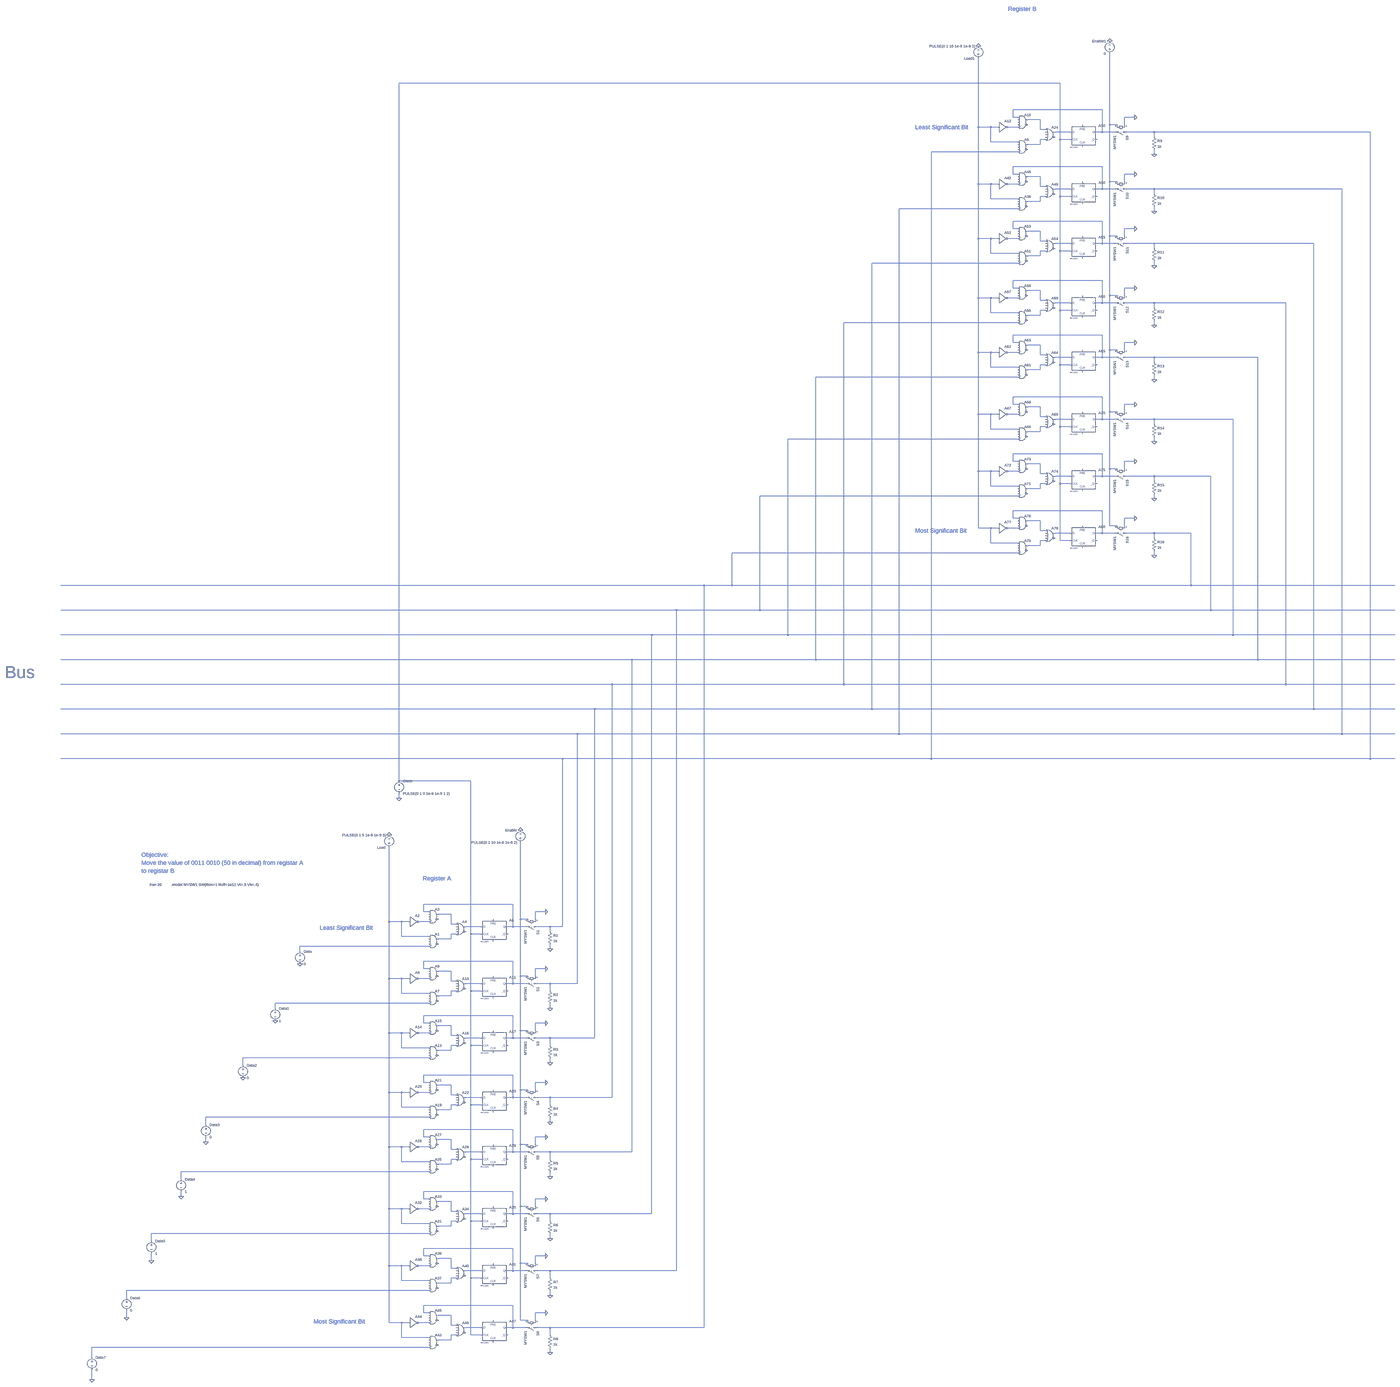
[diagram p0: schematic 8 Bit Register Transfer.asc, whole sheet]
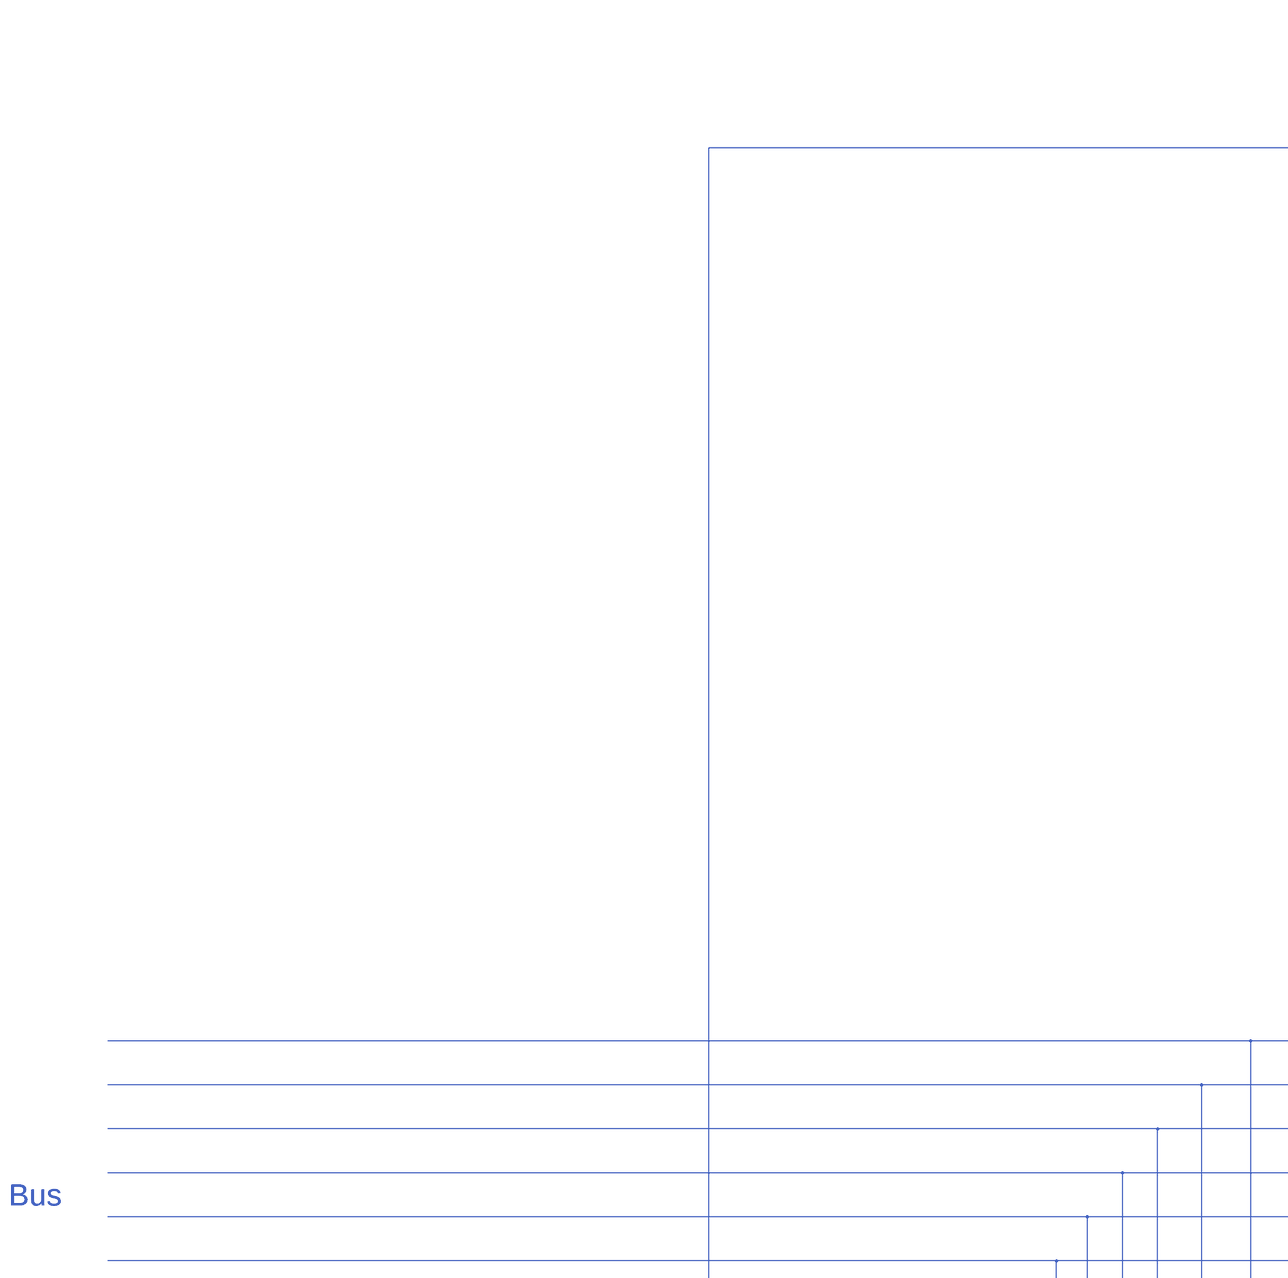
[diagram p1: schematic 8 Bit Register Transfer.asc, part, row 1 of 2, column 1 of 2]
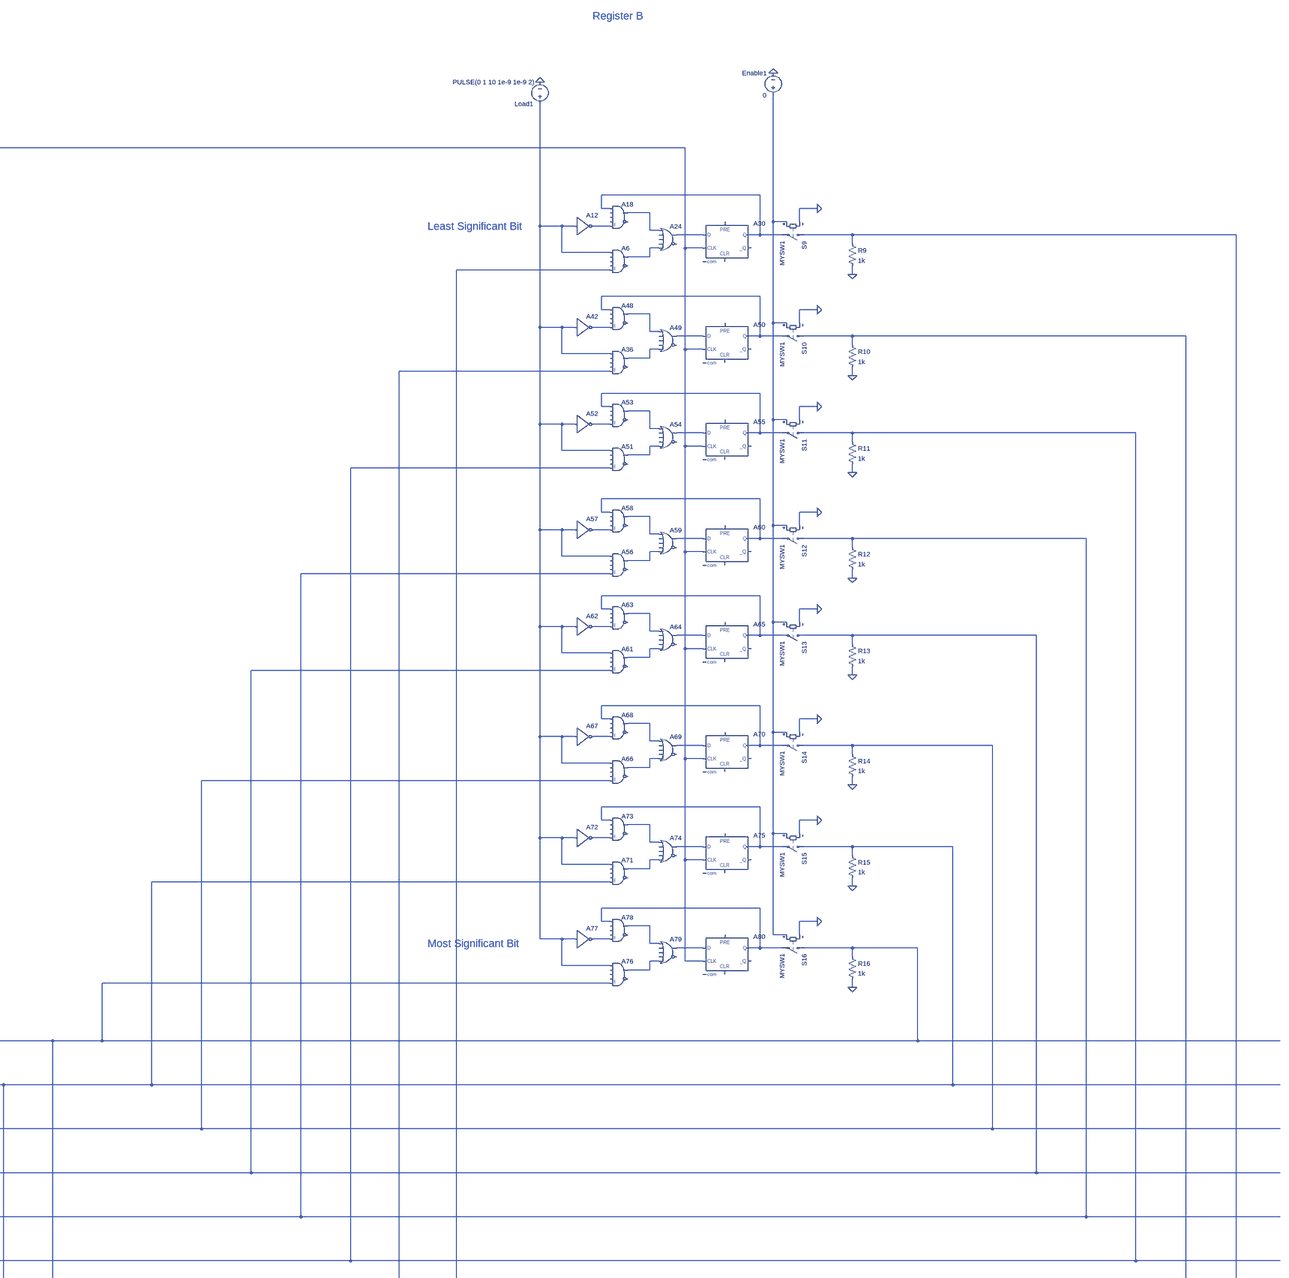
[diagram p2: schematic 8 Bit Register Transfer.asc, part, row 1 of 2, column 2 of 2]
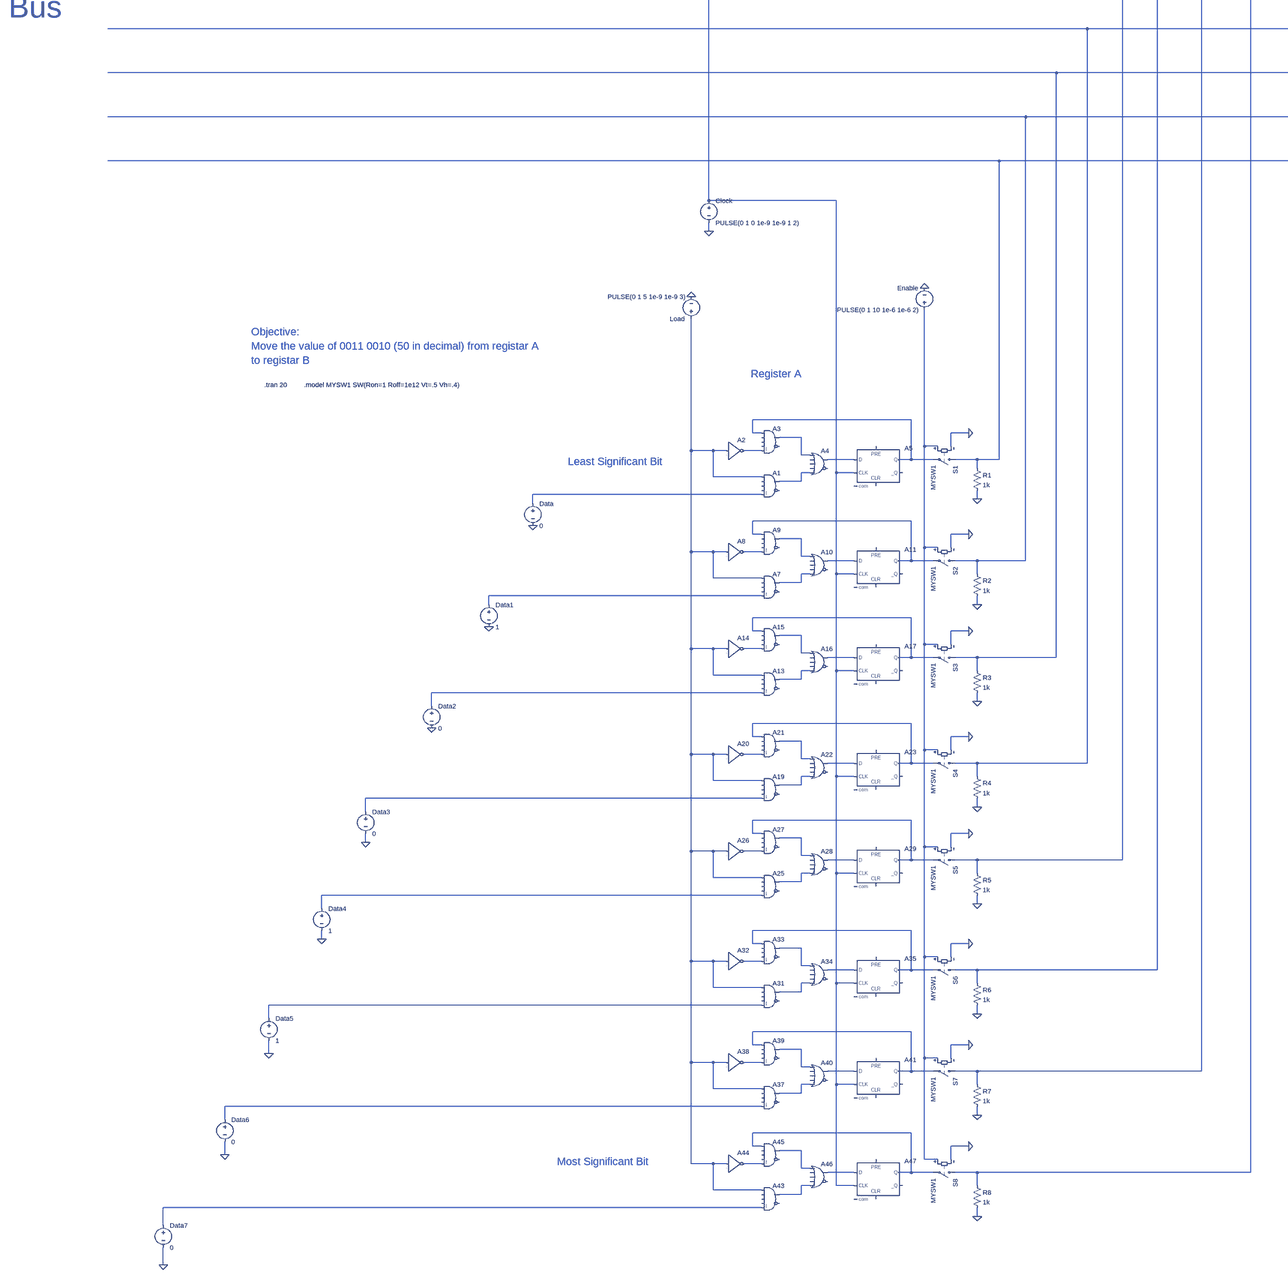
[diagram p3: schematic 8 Bit Register Transfer.asc, part, row 2 of 2, column 1 of 2]
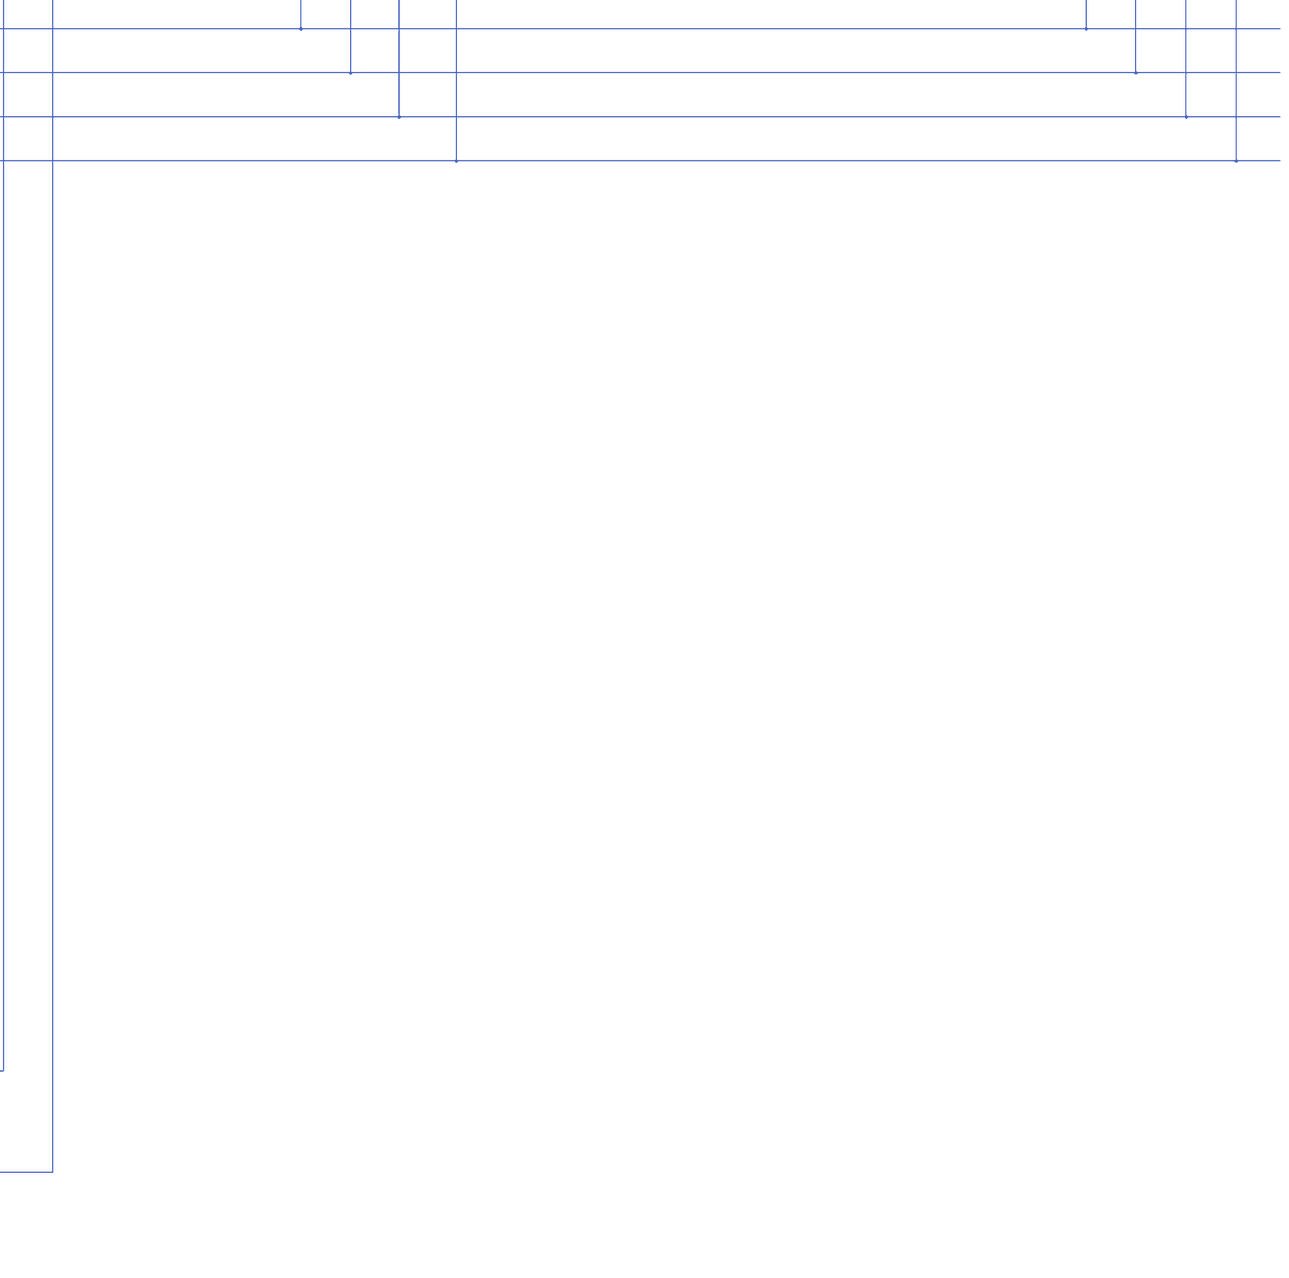
[diagram p4: schematic 8 Bit Register Transfer.asc, part, row 2 of 2, column 2 of 2]
8 Bit Register Transfer.asc, the LTspice schematic file:
Version 4
SHEET 1 12628 3668
WIRE 10256 -6368 4304 -6368
WIRE 10528 -6160 9952 -6160
WIRE 9952 -6112 9952 -6160
WIRE 9984 -6112 9952 -6112
WIRE 10736 -6112 10672 -6112
WIRE 10128 -6096 10048 -6096
WIRE 10576 -6064 10576 -6560
WIRE 10624 -6064 10576 -6064
WIRE 10672 -6064 10672 -6112
WIRE 9728 -6048 9728 -6528
WIRE 9808 -6048 9728 -6048
WIRE 9856 -6048 9808 -6048
WIRE 9984 -6048 9920 -6048
WIRE 10128 -6032 10128 -6096
WIRE 10160 -6032 10128 -6032
WIRE 10320 -6016 10224 -6016
WIRE 10528 -6016 10528 -6160
WIRE 10528 -6016 10480 -6016
WIRE 10608 -6016 10528 -6016
WIRE 10864 -6016 10688 -6016
WIRE 12464 -6016 10864 -6016
WIRE 10864 -5984 10864 -6016
WIRE 10160 -5968 10128 -5968
WIRE 10256 -5968 10256 -6368
WIRE 10320 -5968 10256 -5968
WIRE 9808 -5952 9808 -6048
WIRE 9984 -5952 9808 -5952
WIRE 10128 -5936 10128 -5968
WIRE 10128 -5936 10048 -5936
WIRE 9984 -5888 9424 -5888
WIRE 10864 -5872 10864 -5904
WIRE 10528 -5792 9952 -5792
WIRE 9952 -5744 9952 -5792
WIRE 9984 -5744 9952 -5744
WIRE 10736 -5744 10672 -5744
WIRE 10128 -5728 10048 -5728
WIRE 10576 -5696 10576 -6064
WIRE 10624 -5696 10576 -5696
WIRE 10672 -5696 10672 -5744
WIRE 9728 -5680 9728 -6048
WIRE 9808 -5680 9728 -5680
WIRE 9856 -5680 9808 -5680
WIRE 9984 -5680 9920 -5680
WIRE 10128 -5664 10128 -5728
WIRE 10160 -5664 10128 -5664
WIRE 10320 -5648 10224 -5648
WIRE 10528 -5648 10528 -5792
WIRE 10528 -5648 10480 -5648
WIRE 10608 -5648 10528 -5648
WIRE 10864 -5648 10688 -5648
WIRE 12208 -5648 10864 -5648
WIRE 10864 -5616 10864 -5648
WIRE 10160 -5600 10128 -5600
WIRE 10256 -5600 10256 -5968
WIRE 10320 -5600 10256 -5600
WIRE 9808 -5584 9808 -5680
WIRE 9984 -5584 9808 -5584
WIRE 10128 -5568 10128 -5600
WIRE 10128 -5568 10048 -5568
WIRE 9984 -5520 9216 -5520
WIRE 10864 -5504 10864 -5536
WIRE 10528 -5440 9952 -5440
WIRE 9952 -5392 9952 -5440
WIRE 9984 -5392 9952 -5392
WIRE 10736 -5392 10672 -5392
WIRE 10128 -5376 10048 -5376
WIRE 10576 -5344 10576 -5696
WIRE 10624 -5344 10576 -5344
WIRE 10672 -5344 10672 -5392
WIRE 9728 -5328 9728 -5680
WIRE 9808 -5328 9728 -5328
WIRE 9856 -5328 9808 -5328
WIRE 9984 -5328 9920 -5328
WIRE 10128 -5312 10128 -5376
WIRE 10160 -5312 10128 -5312
WIRE 10320 -5296 10224 -5296
WIRE 10528 -5296 10528 -5440
WIRE 10528 -5296 10480 -5296
WIRE 10608 -5296 10528 -5296
WIRE 10864 -5296 10688 -5296
WIRE 11984 -5296 10864 -5296
WIRE 10864 -5264 10864 -5296
WIRE 10160 -5248 10128 -5248
WIRE 10256 -5248 10256 -5600
WIRE 10320 -5248 10256 -5248
WIRE 9808 -5232 9808 -5328
WIRE 9984 -5232 9808 -5232
WIRE 10128 -5216 10128 -5248
WIRE 10128 -5216 10048 -5216
WIRE 9984 -5168 9040 -5168
WIRE 10864 -5152 10864 -5184
WIRE 10528 -5056 9952 -5056
WIRE 9952 -5008 9952 -5056
WIRE 9984 -5008 9952 -5008
WIRE 10736 -5008 10672 -5008
WIRE 10128 -4992 10048 -4992
WIRE 10576 -4960 10576 -5344
WIRE 10624 -4960 10576 -4960
WIRE 10672 -4960 10672 -5008
WIRE 9728 -4944 9728 -5328
WIRE 9808 -4944 9728 -4944
WIRE 9856 -4944 9808 -4944
WIRE 9984 -4944 9920 -4944
WIRE 10128 -4928 10128 -4992
WIRE 10160 -4928 10128 -4928
WIRE 10320 -4912 10224 -4912
WIRE 10528 -4912 10528 -5056
WIRE 10528 -4912 10480 -4912
WIRE 10608 -4912 10528 -4912
WIRE 10864 -4912 10688 -4912
WIRE 11744 -4912 10864 -4912
WIRE 10864 -4880 10864 -4912
WIRE 10160 -4864 10128 -4864
WIRE 10256 -4864 10256 -5248
WIRE 10320 -4864 10256 -4864
WIRE 9808 -4848 9808 -4944
WIRE 9984 -4848 9808 -4848
WIRE 10128 -4832 10128 -4864
WIRE 10128 -4832 10048 -4832
WIRE 9984 -4784 8848 -4784
WIRE 10864 -4768 10864 -4800
WIRE 10528 -4704 9952 -4704
WIRE 9952 -4656 9952 -4704
WIRE 9984 -4656 9952 -4656
WIRE 10736 -4656 10672 -4656
WIRE 10128 -4640 10048 -4640
WIRE 10576 -4608 10576 -4960
WIRE 10624 -4608 10576 -4608
WIRE 10672 -4608 10672 -4656
WIRE 9728 -4592 9728 -4944
WIRE 9808 -4592 9728 -4592
WIRE 9856 -4592 9808 -4592
WIRE 9984 -4592 9920 -4592
WIRE 10128 -4576 10128 -4640
WIRE 10160 -4576 10128 -4576
WIRE 10320 -4560 10224 -4560
WIRE 10528 -4560 10528 -4704
WIRE 10528 -4560 10480 -4560
WIRE 10608 -4560 10528 -4560
WIRE 10864 -4560 10688 -4560
WIRE 11536 -4560 10864 -4560
WIRE 10864 -4528 10864 -4560
WIRE 10160 -4512 10128 -4512
WIRE 10256 -4512 10256 -4864
WIRE 10320 -4512 10256 -4512
WIRE 9808 -4496 9808 -4592
WIRE 9984 -4496 9808 -4496
WIRE 10128 -4480 10128 -4512
WIRE 10128 -4480 10048 -4480
WIRE 9984 -4432 8640 -4432
WIRE 10864 -4416 10864 -4448
WIRE 10528 -4304 9952 -4304
WIRE 9952 -4256 9952 -4304
WIRE 9984 -4256 9952 -4256
WIRE 10736 -4256 10672 -4256
WIRE 10128 -4240 10048 -4240
WIRE 10576 -4208 10576 -4608
WIRE 10624 -4208 10576 -4208
WIRE 10672 -4208 10672 -4256
WIRE 9728 -4192 9728 -4592
WIRE 9808 -4192 9728 -4192
WIRE 9856 -4192 9808 -4192
WIRE 9984 -4192 9920 -4192
WIRE 10128 -4176 10128 -4240
WIRE 10160 -4176 10128 -4176
WIRE 10320 -4160 10224 -4160
WIRE 10528 -4160 10528 -4304
WIRE 10528 -4160 10480 -4160
WIRE 10608 -4160 10528 -4160
WIRE 10864 -4160 10688 -4160
WIRE 11376 -4160 10864 -4160
WIRE 10864 -4128 10864 -4160
WIRE 10160 -4112 10128 -4112
WIRE 10256 -4112 10256 -4512
WIRE 10320 -4112 10256 -4112
WIRE 9808 -4096 9808 -4192
WIRE 9984 -4096 9808 -4096
WIRE 10128 -4080 10128 -4112
WIRE 10128 -4080 10048 -4080
WIRE 9984 -4032 8416 -4032
WIRE 10864 -4016 10864 -4048
WIRE 10528 -3936 9952 -3936
WIRE 9952 -3888 9952 -3936
WIRE 9984 -3888 9952 -3888
WIRE 10736 -3888 10672 -3888
WIRE 10128 -3872 10048 -3872
WIRE 10576 -3840 10576 -4208
WIRE 10624 -3840 10576 -3840
WIRE 10672 -3840 10672 -3888
WIRE 9728 -3824 9728 -4192
WIRE 9808 -3824 9728 -3824
WIRE 9856 -3824 9808 -3824
WIRE 9984 -3824 9920 -3824
WIRE 10128 -3808 10128 -3872
WIRE 10160 -3808 10128 -3808
WIRE 10320 -3792 10224 -3792
WIRE 10528 -3792 10528 -3936
WIRE 10528 -3792 10480 -3792
WIRE 10608 -3792 10528 -3792
WIRE 10864 -3792 10688 -3792
WIRE 11232 -3792 10864 -3792
WIRE 10864 -3760 10864 -3792
WIRE 10160 -3744 10128 -3744
WIRE 10256 -3744 10256 -4112
WIRE 10320 -3744 10256 -3744
WIRE 9808 -3728 9808 -3824
WIRE 9984 -3728 9808 -3728
WIRE 10128 -3712 10128 -3744
WIRE 10128 -3712 10048 -3712
WIRE 9984 -3664 8224 -3664
WIRE 10864 -3648 10864 -3680
WIRE 10528 -3568 9952 -3568
WIRE 9952 -3520 9952 -3568
WIRE 9984 -3520 9952 -3520
WIRE 10736 -3520 10672 -3520
WIRE 10128 -3504 10048 -3504
WIRE 10576 -3472 10576 -3840
WIRE 10624 -3472 10576 -3472
WIRE 10672 -3472 10672 -3520
WIRE 9728 -3456 9728 -3824
WIRE 9808 -3456 9728 -3456
WIRE 9856 -3456 9808 -3456
WIRE 9984 -3456 9920 -3456
WIRE 10128 -3440 10128 -3504
WIRE 10160 -3440 10128 -3440
WIRE 10320 -3424 10224 -3424
WIRE 10528 -3424 10528 -3568
WIRE 10528 -3424 10480 -3424
WIRE 10608 -3424 10528 -3424
WIRE 10864 -3424 10688 -3424
WIRE 11104 -3424 10864 -3424
WIRE 10864 -3392 10864 -3424
WIRE 10160 -3376 10128 -3376
WIRE 10256 -3376 10256 -3744
WIRE 10320 -3376 10256 -3376
WIRE 9808 -3360 9808 -3456
WIRE 9984 -3360 9808 -3360
WIRE 10128 -3344 10128 -3376
WIRE 10128 -3344 10048 -3344
WIRE 9984 -3296 8000 -3296
WIRE 10864 -3280 10864 -3312
WIRE 6288 -2912 128 -2912
WIRE 8000 -2912 8000 -3296
WIRE 8000 -2912 6288 -2912
WIRE 11104 -2912 11104 -3424
WIRE 11104 -2912 8000 -2912
WIRE 12624 -2912 11104 -2912
WIRE 6096 -2752 128 -2752
WIRE 8224 -2752 8224 -3664
WIRE 8224 -2752 6096 -2752
WIRE 11232 -2752 11232 -3792
WIRE 11232 -2752 8224 -2752
WIRE 12624 -2752 11232 -2752
WIRE 5936 -2592 128 -2592
WIRE 8416 -2592 8416 -4032
WIRE 8416 -2592 5936 -2592
WIRE 11376 -2592 11376 -4160
WIRE 11376 -2592 8416 -2592
WIRE 12624 -2592 11376 -2592
WIRE 5808 -2432 128 -2432
WIRE 8640 -2432 8640 -4432
WIRE 8640 -2432 5808 -2432
WIRE 11536 -2432 11536 -4560
WIRE 11536 -2432 8640 -2432
WIRE 12624 -2432 11536 -2432
WIRE 5680 -2272 128 -2272
WIRE 8848 -2272 8848 -4784
WIRE 8848 -2272 5680 -2272
WIRE 11744 -2272 11744 -4912
WIRE 11744 -2272 8848 -2272
WIRE 12624 -2272 11744 -2272
WIRE 5568 -2112 128 -2112
WIRE 9040 -2112 9040 -5168
WIRE 9040 -2112 5568 -2112
WIRE 11984 -2112 11984 -5296
WIRE 11984 -2112 9040 -2112
WIRE 12624 -2112 11984 -2112
WIRE 5456 -1952 128 -1952
WIRE 9216 -1952 9216 -5520
WIRE 9216 -1952 5456 -1952
WIRE 12208 -1952 12208 -5648
WIRE 12208 -1952 9216 -1952
WIRE 12624 -1952 12208 -1952
WIRE 5360 -1792 128 -1792
WIRE 9424 -1792 9424 -5888
WIRE 9424 -1792 5360 -1792
WIRE 12464 -1792 12464 -6016
WIRE 12464 -1792 9424 -1792
WIRE 12624 -1792 12464 -1792
WIRE 4304 -1648 4304 -6368
WIRE 4768 -1648 4304 -1648
WIRE 4304 -1536 4304 -1568
WIRE 5040 -848 4464 -848
WIRE 4464 -800 4464 -848
WIRE 4496 -800 4464 -800
WIRE 5248 -800 5184 -800
WIRE 4640 -784 4560 -784
WIRE 5088 -752 5088 -1248
WIRE 5136 -752 5088 -752
WIRE 5184 -752 5184 -800
WIRE 4240 -736 4240 -1216
WIRE 4320 -736 4240 -736
WIRE 4368 -736 4320 -736
WIRE 4496 -736 4432 -736
WIRE 4640 -720 4640 -784
WIRE 4672 -720 4640 -720
WIRE 4832 -704 4736 -704
WIRE 5040 -704 5040 -848
WIRE 5040 -704 4992 -704
WIRE 5120 -704 5040 -704
WIRE 5280 -704 5200 -704
WIRE 5360 -704 5360 -1792
WIRE 5360 -704 5280 -704
WIRE 5280 -672 5280 -704
WIRE 4672 -656 4640 -656
WIRE 4768 -656 4768 -1648
WIRE 4832 -656 4768 -656
WIRE 4320 -640 4320 -736
WIRE 4496 -640 4320 -640
WIRE 4640 -624 4640 -656
WIRE 4640 -624 4560 -624
WIRE 4496 -576 3664 -576
WIRE 5280 -560 5280 -592
WIRE 3664 -544 3664 -576
WIRE 5040 -480 4464 -480
WIRE 4464 -432 4464 -480
WIRE 4496 -432 4464 -432
WIRE 5248 -432 5184 -432
WIRE 4640 -416 4560 -416
WIRE 5088 -384 5088 -752
WIRE 5136 -384 5088 -384
WIRE 5184 -384 5184 -432
WIRE 4240 -368 4240 -736
WIRE 4320 -368 4240 -368
WIRE 4368 -368 4320 -368
WIRE 4496 -368 4432 -368
WIRE 4640 -352 4640 -416
WIRE 4672 -352 4640 -352
WIRE 4832 -336 4736 -336
WIRE 5040 -336 5040 -480
WIRE 5040 -336 4992 -336
WIRE 5120 -336 5040 -336
WIRE 5280 -336 5200 -336
WIRE 5456 -336 5456 -1952
WIRE 5456 -336 5280 -336
WIRE 4672 -288 4640 -288
WIRE 4768 -288 4768 -656
WIRE 4832 -288 4768 -288
WIRE 5280 -288 5280 -336
WIRE 4320 -272 4320 -368
WIRE 4496 -272 4320 -272
WIRE 4640 -256 4640 -288
WIRE 4640 -256 4560 -256
WIRE 4496 -208 3504 -208
WIRE 3504 -176 3504 -208
WIRE 5280 -176 5280 -208
WIRE 5040 -128 4464 -128
WIRE 4464 -80 4464 -128
WIRE 4496 -80 4464 -80
WIRE 5248 -80 5184 -80
WIRE 4640 -64 4560 -64
WIRE 5088 -32 5088 -384
WIRE 5136 -32 5088 -32
WIRE 5184 -32 5184 -80
WIRE 4240 -16 4240 -368
WIRE 4320 -16 4240 -16
WIRE 4368 -16 4320 -16
WIRE 4496 -16 4432 -16
WIRE 4640 0 4640 -64
WIRE 4672 0 4640 0
WIRE 4832 16 4736 16
WIRE 5040 16 5040 -128
WIRE 5040 16 4992 16
WIRE 5120 16 5040 16
WIRE 5280 16 5200 16
WIRE 5568 16 5568 -2112
WIRE 5568 16 5280 16
WIRE 4672 64 4640 64
WIRE 4768 64 4768 -288
WIRE 4832 64 4768 64
WIRE 5280 64 5280 16
WIRE 4320 80 4320 -16
WIRE 4496 80 4320 80
WIRE 4640 96 4640 64
WIRE 4640 96 4560 96
WIRE 4496 144 3296 144
WIRE 5280 176 5280 144
WIRE 3296 192 3296 144
WIRE 5040 256 4464 256
WIRE 4464 304 4464 256
WIRE 4496 304 4464 304
WIRE 5248 304 5184 304
WIRE 4640 320 4560 320
WIRE 5088 352 5088 -32
WIRE 5136 352 5088 352
WIRE 5184 352 5184 304
WIRE 4240 368 4240 -16
WIRE 4320 368 4240 368
WIRE 4368 368 4320 368
WIRE 4496 368 4432 368
WIRE 4640 384 4640 320
WIRE 4672 384 4640 384
WIRE 4832 400 4736 400
WIRE 5040 400 5040 256
WIRE 5040 400 4992 400
WIRE 5120 400 5040 400
WIRE 5280 400 5200 400
WIRE 5680 400 5680 -2272
WIRE 5680 400 5280 400
WIRE 4672 448 4640 448
WIRE 4768 448 4768 64
WIRE 4832 448 4768 448
WIRE 5280 448 5280 400
WIRE 4320 464 4320 368
WIRE 4496 464 4320 464
WIRE 4640 480 4640 448
WIRE 4640 480 4560 480
WIRE 4496 528 3056 528
WIRE 5280 560 5280 528
WIRE 3056 576 3056 528
WIRE 5040 608 4464 608
WIRE 4464 656 4464 608
WIRE 4496 656 4464 656
WIRE 5248 656 5184 656
WIRE 4640 672 4560 672
WIRE 3056 688 3056 656
WIRE 5088 704 5088 352
WIRE 5136 704 5088 704
WIRE 5184 704 5184 656
WIRE 4240 720 4240 368
WIRE 4320 720 4240 720
WIRE 4368 720 4320 720
WIRE 4496 720 4432 720
WIRE 4640 736 4640 672
WIRE 4672 736 4640 736
WIRE 4832 752 4736 752
WIRE 5040 752 5040 608
WIRE 5040 752 4992 752
WIRE 5120 752 5040 752
WIRE 5280 752 5200 752
WIRE 5808 752 5808 -2432
WIRE 5808 752 5280 752
WIRE 4672 800 4640 800
WIRE 4768 800 4768 448
WIRE 4832 800 4768 800
WIRE 5280 800 5280 752
WIRE 4320 816 4320 720
WIRE 4496 816 4320 816
WIRE 4640 832 4640 800
WIRE 4640 832 4560 832
WIRE 4496 880 2896 880
WIRE 5280 912 5280 880
WIRE 2896 928 2896 880
WIRE 5040 1008 4464 1008
WIRE 2896 1040 2896 1008
WIRE 4464 1056 4464 1008
WIRE 4496 1056 4464 1056
WIRE 5248 1056 5184 1056
WIRE 4640 1072 4560 1072
WIRE 5088 1104 5088 704
WIRE 5136 1104 5088 1104
WIRE 5184 1104 5184 1056
WIRE 4240 1120 4240 720
WIRE 4320 1120 4240 1120
WIRE 4368 1120 4320 1120
WIRE 4496 1120 4432 1120
WIRE 4640 1136 4640 1072
WIRE 4672 1136 4640 1136
WIRE 4832 1152 4736 1152
WIRE 5040 1152 5040 1008
WIRE 5040 1152 4992 1152
WIRE 5120 1152 5040 1152
WIRE 5280 1152 5200 1152
WIRE 5936 1152 5936 -2592
WIRE 5936 1152 5280 1152
WIRE 4672 1200 4640 1200
WIRE 4768 1200 4768 800
WIRE 4832 1200 4768 1200
WIRE 5280 1200 5280 1152
WIRE 4320 1216 4320 1120
WIRE 4496 1216 4320 1216
WIRE 4640 1232 4640 1200
WIRE 4640 1232 4560 1232
WIRE 4496 1280 2704 1280
WIRE 5280 1312 5280 1280
WIRE 2704 1328 2704 1280
WIRE 5040 1376 4464 1376
WIRE 4464 1424 4464 1376
WIRE 4496 1424 4464 1424
WIRE 5248 1424 5184 1424
WIRE 4640 1440 4560 1440
WIRE 2704 1456 2704 1408
WIRE 5088 1472 5088 1104
WIRE 5136 1472 5088 1472
WIRE 5184 1472 5184 1424
WIRE 4240 1488 4240 1120
WIRE 4320 1488 4240 1488
WIRE 4368 1488 4320 1488
WIRE 4496 1488 4432 1488
WIRE 4640 1504 4640 1440
WIRE 4672 1504 4640 1504
WIRE 4832 1520 4736 1520
WIRE 5040 1520 5040 1376
WIRE 5040 1520 4992 1520
WIRE 5120 1520 5040 1520
WIRE 5280 1520 5200 1520
WIRE 6096 1520 6096 -2752
WIRE 6096 1520 5280 1520
WIRE 4672 1568 4640 1568
WIRE 4768 1568 4768 1200
WIRE 4832 1568 4768 1568
WIRE 5280 1568 5280 1520
WIRE 4320 1584 4320 1488
WIRE 4496 1584 4320 1584
WIRE 4640 1600 4640 1568
WIRE 4640 1600 4560 1600
WIRE 4496 1648 2544 1648
WIRE 5280 1680 5280 1648
WIRE 2544 1696 2544 1648
WIRE 5040 1744 4464 1744
WIRE 4464 1792 4464 1744
WIRE 4496 1792 4464 1792
WIRE 5248 1792 5184 1792
WIRE 4640 1808 4560 1808
WIRE 2544 1824 2544 1776
WIRE 5088 1840 5088 1472
WIRE 5136 1840 5088 1840
WIRE 5184 1840 5184 1792
WIRE 4240 1856 4240 1488
WIRE 4320 1856 4240 1856
WIRE 4368 1856 4320 1856
WIRE 4496 1856 4432 1856
WIRE 4640 1872 4640 1808
WIRE 4672 1872 4640 1872
WIRE 4832 1888 4736 1888
WIRE 5040 1888 5040 1744
WIRE 5040 1888 4992 1888
WIRE 5120 1888 5040 1888
WIRE 5280 1888 5200 1888
WIRE 6288 1888 6288 -2912
WIRE 6288 1888 5280 1888
WIRE 4672 1936 4640 1936
WIRE 4768 1936 4768 1568
WIRE 4832 1936 4768 1936
WIRE 5280 1936 5280 1888
WIRE 4320 1952 4320 1856
WIRE 4496 1952 4320 1952
WIRE 4640 1968 4640 1936
WIRE 4640 1968 4560 1968
WIRE 4496 2016 2320 2016
WIRE 5280 2048 5280 2016
WIRE 2320 2080 2320 2016
WIRE 2320 2224 2320 2160
FLAG 3664 -464 0
FLAG 4240 -1296 0
FLAG 3504 -96 0
FLAG 3296 272 0
FLAG 3056 688 0
FLAG 2896 1040 0
FLAG 2704 1456 0
FLAG 2544 1824 0
FLAG 2320 2224 0
FLAG 5248 -800 0
FLAG 5088 -1328 0
FLAG 5248 -432 0
FLAG 5248 -80 0
FLAG 5248 304 0
FLAG 5248 656 0
FLAG 5248 1056 0
FLAG 5248 1424 0
FLAG 5248 1792 0
FLAG 9728 -6608 0
FLAG 10736 -6112 0
FLAG 10576 -6640 0
FLAG 10736 -5744 0
FLAG 10736 -5392 0
FLAG 10736 -5008 0
FLAG 10736 -4656 0
FLAG 10736 -4256 0
FLAG 10736 -3888 0
FLAG 10736 -3520 0
FLAG 5280 -560 0
FLAG 5280 -176 0
FLAG 5280 176 0
FLAG 5280 560 0
FLAG 5280 912 0
FLAG 5280 1312 0
FLAG 5280 1680 0
FLAG 5280 2048 0
FLAG 4304 -1536 0
FLAG 10864 -5872 0
FLAG 10864 -5504 0
FLAG 10864 -5152 0
FLAG 10864 -4768 0
FLAG 10864 -4416 0
FLAG 10864 -4016 0
FLAG 10864 -3648 0
FLAG 10864 -3280 0
SYMBOL voltage 3664 -560 R0
WINDOW 123 0 0 Left 0
WINDOW 39 0 0 Left 0
SYMATTR InstName Data
SYMATTR Value 0
SYMBOL voltage 4240 -1200 R180
WINDOW 123 0 0 Left 0
WINDOW 39 0 0 Left 0
SYMATTR InstName Load
SYMATTR Value PULSE(0 1 5 1e-9 1e-9 3)
SYMBOL Digital\\and 4528 -672 R0
SYMATTR InstName A1
SYMBOL Digital\\inv 4368 -800 R0
SYMATTR InstName A2
SYMBOL Digital\\and 4528 -832 R0
SYMATTR InstName A3
SYMBOL Digital\\or 4704 -752 R0
SYMATTR InstName A4
SYMBOL Digital\\dflop 4912 -752 R0
SYMATTR InstName A5
SYMBOL voltage 4304 -1664 R0
WINDOW 123 0 0 Left 0
WINDOW 39 0 0 Left 0
SYMATTR InstName Clock
SYMATTR Value PULSE(0 1 0 1e-9 1e-9 1 2)
SYMBOL Digital\\and 4528 -304 R0
SYMATTR InstName A7
SYMBOL Digital\\inv 4368 -432 R0
SYMATTR InstName A8
SYMBOL Digital\\and 4528 -464 R0
SYMATTR InstName A9
SYMBOL Digital\\or 4704 -384 R0
SYMATTR InstName A10
SYMBOL Digital\\dflop 4912 -384 R0
SYMATTR InstName A11
SYMBOL Digital\\and 4528 48 R0
SYMATTR InstName A13
SYMBOL Digital\\inv 4368 -80 R0
SYMATTR InstName A14
SYMBOL Digital\\and 4528 -112 R0
SYMATTR InstName A15
SYMBOL Digital\\or 4704 -32 R0
SYMATTR InstName A16
SYMBOL Digital\\dflop 4912 -32 R0
SYMATTR InstName A17
SYMBOL Digital\\and 4528 432 R0
SYMATTR InstName A19
SYMBOL Digital\\inv 4368 304 R0
SYMATTR InstName A20
SYMBOL Digital\\and 4528 272 R0
SYMATTR InstName A21
SYMBOL Digital\\or 4704 352 R0
SYMATTR InstName A22
SYMBOL Digital\\dflop 4912 352 R0
SYMATTR InstName A23
SYMBOL Digital\\and 4528 784 R0
SYMATTR InstName A25
SYMBOL Digital\\inv 4368 656 R0
SYMATTR InstName A26
SYMBOL Digital\\and 4528 624 R0
SYMATTR InstName A27
SYMBOL Digital\\or 4704 704 R0
SYMATTR InstName A28
SYMBOL Digital\\dflop 4912 704 R0
SYMATTR InstName A29
SYMBOL Digital\\and 4528 1184 R0
SYMATTR InstName A31
SYMBOL Digital\\inv 4368 1056 R0
SYMATTR InstName A32
SYMBOL Digital\\and 4528 1024 R0
SYMATTR InstName A33
SYMBOL Digital\\or 4704 1104 R0
SYMATTR InstName A34
SYMBOL Digital\\dflop 4912 1104 R0
SYMATTR InstName A35
SYMBOL Digital\\and 4528 1552 R0
SYMATTR InstName A37
SYMBOL Digital\\inv 4368 1424 R0
SYMATTR InstName A38
SYMBOL Digital\\and 4528 1392 R0
SYMATTR InstName A39
SYMBOL Digital\\or 4704 1472 R0
SYMATTR InstName A40
SYMBOL Digital\\dflop 4912 1472 R0
SYMATTR InstName A41
SYMBOL Digital\\and 4528 1920 R0
SYMATTR InstName A43
SYMBOL Digital\\inv 4368 1792 R0
SYMATTR InstName A44
SYMBOL Digital\\and 4528 1760 R0
SYMATTR InstName A45
SYMBOL Digital\\or 4704 1840 R0
SYMATTR InstName A46
SYMBOL Digital\\dflop 4912 1840 R0
SYMATTR InstName A47
SYMBOL voltage 3504 -192 R0
WINDOW 123 0 0 Left 0
WINDOW 39 0 0 Left 0
SYMATTR InstName Data1
SYMATTR Value 1
SYMBOL voltage 3296 176 R0
WINDOW 123 0 0 Left 0
WINDOW 39 0 0 Left 0
SYMATTR InstName Data2
SYMATTR Value 0
SYMBOL voltage 3056 560 R0
WINDOW 123 0 0 Left 0
WINDOW 39 0 0 Left 0
SYMATTR InstName Data3
SYMATTR Value 0
SYMBOL voltage 2896 912 R0
WINDOW 123 0 0 Left 0
WINDOW 39 0 0 Left 0
SYMATTR InstName Data4
SYMATTR Value 1
SYMBOL voltage 2704 1312 R0
WINDOW 123 0 0 Left 0
WINDOW 39 0 0 Left 0
SYMATTR InstName Data5
SYMATTR Value 1
SYMBOL voltage 2544 1680 R0
WINDOW 123 0 0 Left 0
WINDOW 39 0 0 Left 0
SYMATTR InstName Data6
SYMATTR Value 0
SYMBOL voltage 2320 2064 R0
WINDOW 123 0 0 Left 0
WINDOW 39 0 0 Left 0
SYMATTR InstName Data7
SYMATTR Value 0
SYMBOL voltage 5088 -1232 R180
WINDOW 0 24 96 Left 2
WINDOW 3 24 16 Left 2
WINDOW 123 0 0 Left 0
WINDOW 39 0 0 Left 0
SYMATTR InstName Enable
SYMATTR Value PULSE(0 1 10 1e-6 1e-6 2)
SYMBOL sw 5216 -704 R90
SYMATTR InstName S1
SYMATTR Value MYSW1
SYMBOL sw 5216 -336 R90
SYMATTR InstName S2
SYMATTR Value MYSW1
SYMBOL sw 5216 16 R90
SYMATTR InstName S3
SYMATTR Value MYSW1
SYMBOL sw 5216 400 R90
SYMATTR InstName S4
SYMATTR Value MYSW1
SYMBOL sw 5216 752 R90
SYMATTR InstName S5
SYMATTR Value MYSW1
SYMBOL sw 5216 1152 R90
SYMATTR InstName S6
SYMATTR Value MYSW1
SYMBOL sw 5216 1520 R90
SYMATTR InstName S7
SYMATTR Value MYSW1
SYMBOL sw 5216 1888 R90
SYMATTR InstName S8
SYMATTR Value MYSW1
SYMBOL voltage 9728 -6512 R180
WINDOW 123 0 0 Left 0
WINDOW 39 0 0 Left 0
SYMATTR InstName Load1
SYMATTR Value PULSE(0 1 10 1e-9 1e-9 2)
SYMBOL Digital\\and 10016 -5984 R0
SYMATTR InstName A6
SYMBOL Digital\\inv 9856 -6112 R0
SYMATTR InstName A12
SYMBOL Digital\\and 10016 -6144 R0
SYMATTR InstName A18
SYMBOL Digital\\or 10192 -6064 R0
SYMATTR InstName A24
SYMBOL Digital\\dflop 10400 -6064 R0
SYMATTR InstName A30
SYMBOL Digital\\and 10016 -5616 R0
SYMATTR InstName A36
SYMBOL Digital\\inv 9856 -5744 R0
SYMATTR InstName A42
SYMBOL Digital\\and 10016 -5776 R0
SYMATTR InstName A48
SYMBOL Digital\\or 10192 -5696 R0
SYMATTR InstName A49
SYMBOL Digital\\dflop 10400 -5696 R0
SYMATTR InstName A50
SYMBOL Digital\\and 10016 -5264 R0
SYMATTR InstName A51
SYMBOL Digital\\inv 9856 -5392 R0
SYMATTR InstName A52
SYMBOL Digital\\and 10016 -5424 R0
SYMATTR InstName A53
SYMBOL Digital\\or 10192 -5344 R0
SYMATTR InstName A54
SYMBOL Digital\\dflop 10400 -5344 R0
SYMATTR InstName A55
SYMBOL Digital\\and 10016 -4880 R0
SYMATTR InstName A56
SYMBOL Digital\\inv 9856 -5008 R0
SYMATTR InstName A57
SYMBOL Digital\\and 10016 -5040 R0
SYMATTR InstName A58
SYMBOL Digital\\or 10192 -4960 R0
SYMATTR InstName A59
SYMBOL Digital\\dflop 10400 -4960 R0
SYMATTR InstName A60
SYMBOL Digital\\and 10016 -4528 R0
SYMATTR InstName A61
SYMBOL Digital\\inv 9856 -4656 R0
SYMATTR InstName A62
SYMBOL Digital\\and 10016 -4688 R0
SYMATTR InstName A63
SYMBOL Digital\\or 10192 -4608 R0
SYMATTR InstName A64
SYMBOL Digital\\dflop 10400 -4608 R0
SYMATTR InstName A65
SYMBOL Digital\\and 10016 -4128 R0
SYMATTR InstName A66
SYMBOL Digital\\inv 9856 -4256 R0
SYMATTR InstName A67
SYMBOL Digital\\and 10016 -4288 R0
SYMATTR InstName A68
SYMBOL Digital\\or 10192 -4208 R0
SYMATTR InstName A69
SYMBOL Digital\\dflop 10400 -4208 R0
SYMATTR InstName A70
SYMBOL Digital\\and 10016 -3760 R0
SYMATTR InstName A71
SYMBOL Digital\\inv 9856 -3888 R0
SYMATTR InstName A72
SYMBOL Digital\\and 10016 -3920 R0
SYMATTR InstName A73
SYMBOL Digital\\or 10192 -3840 R0
SYMATTR InstName A74
SYMBOL Digital\\dflop 10400 -3840 R0
SYMATTR InstName A75
SYMBOL Digital\\and 10016 -3392 R0
SYMATTR InstName A76
SYMBOL Digital\\inv 9856 -3520 R0
SYMATTR InstName A77
SYMBOL Digital\\and 10016 -3552 R0
SYMATTR InstName A78
SYMBOL Digital\\or 10192 -3472 R0
SYMATTR InstName A79
SYMBOL Digital\\dflop 10400 -3472 R0
SYMATTR InstName A80
SYMBOL voltage 10576 -6544 R180
WINDOW 0 24 96 Left 2
WINDOW 3 24 16 Left 2
WINDOW 123 0 0 Left 0
WINDOW 39 0 0 Left 0
SYMATTR InstName Enable1
SYMATTR Value 0
SYMBOL sw 10704 -6016 R90
SYMATTR InstName S9
SYMATTR Value MYSW1
SYMBOL sw 10704 -5648 R90
SYMATTR InstName S10
SYMATTR Value MYSW1
SYMBOL sw 10704 -5296 R90
SYMATTR InstName S11
SYMATTR Value MYSW1
SYMBOL sw 10704 -4912 R90
SYMATTR InstName S12
SYMATTR Value MYSW1
SYMBOL sw 10704 -4560 R90
SYMATTR InstName S13
SYMATTR Value MYSW1
SYMBOL sw 10704 -4160 R90
SYMATTR InstName S14
SYMATTR Value MYSW1
SYMBOL sw 10704 -3792 R90
SYMATTR InstName S15
SYMATTR Value MYSW1
SYMBOL sw 10704 -3424 R90
SYMATTR InstName S16
SYMATTR Value MYSW1
SYMBOL res 5264 -688 R0
SYMATTR InstName R1
SYMATTR Value 1k
SYMBOL res 5264 -304 R0
SYMATTR InstName R2
SYMATTR Value 1k
SYMBOL res 5264 48 R0
SYMATTR InstName R3
SYMATTR Value 1k
SYMBOL res 5264 432 R0
SYMATTR InstName R4
SYMATTR Value 1k
SYMBOL res 5264 784 R0
SYMATTR InstName R5
SYMATTR Value 1k
SYMBOL res 5264 1184 R0
SYMATTR InstName R6
SYMATTR Value 1k
SYMBOL res 5264 1552 R0
SYMATTR InstName R7
SYMATTR Value 1k
SYMBOL res 5264 1920 R0
SYMATTR InstName R8
SYMATTR Value 1k
SYMBOL res 10848 -6000 R0
SYMATTR InstName R9
SYMATTR Value 1k
SYMBOL res 10848 -5632 R0
SYMATTR InstName R10
SYMATTR Value 1k
SYMBOL res 10848 -5280 R0
SYMATTR InstName R11
SYMATTR Value 1k
SYMBOL res 10848 -4896 R0
SYMATTR InstName R12
SYMATTR Value 1k
SYMBOL res 10848 -4544 R0
SYMATTR InstName R13
SYMATTR Value 1k
SYMBOL res 10848 -4144 R0
SYMATTR InstName R14
SYMATTR Value 1k
SYMBOL res 10848 -3776 R0
SYMATTR InstName R15
SYMATTR Value 1k
SYMBOL res 10848 -3408 R0
SYMATTR InstName R16
SYMATTR Value 1k
TEXT 2688 -976 Left 2 !.tran 20
TEXT 4456 -1016 Left 4 ;Register A
TEXT 2832 -976 Left 2 !.model MYSW1 SW(Ron=1 Roff=1e12 Vt=.5 Vh=.4)
TEXT 9920 -6872 Left 4 ;Register B
TEXT 3792 -696 Left 4 ;Least Significant Bit
TEXT 3752 1848 Left 4 ;Most Significant Bit
TEXT 2640 -1168 Left 4 ;Objective:\nMove the value of 0011 0010 (50 in decimal) from registar A\nto registar B
TEXT 9320 -6048 Left 4 ;Least Significant Bit
TEXT 9320 -3440 Left 4 ;Most Significant Bit
TEXT -232 -2352 Left 7 ;Bus

The netlist it stands for:
* 8 Bit Register Transfer.asc
V§Data N059 0 0
V§Load N055 0 PULSE(0 1 5 1e-9 1e-9 3)
A1 N055 0 0 0 N059 0 N058 0 AND
A2 N055 0 0 0 0 N056 0 0 BUF
A3 N052 0 0 0 N056 0 N053 0 AND
A4 N053 0 0 0 N058 0 N057 0 OR
A5 N057 0 N001 0 0 0 N052 0 DFLOP
V§Clock N001 0 PULSE(0 1 0 1e-9 1e-9 1 2)
A7 N055 0 0 0 N065 0 N064 0 AND
A8 N055 0 0 0 0 N062 0 0 BUF
A9 N060 0 0 0 N062 0 N061 0 AND
A10 N061 0 0 0 N064 0 N063 0 OR
A11 N063 0 N001 0 0 0 N060 0 DFLOP
A13 N055 0 0 0 N071 0 N070 0 AND
A14 N055 0 0 0 0 N068 0 0 BUF
A15 N066 0 0 0 N068 0 N067 0 AND
A16 N067 0 0 0 N070 0 N069 0 OR
A17 N069 0 N001 0 0 0 N066 0 DFLOP
A19 N055 0 0 0 N077 0 N076 0 AND
A20 N055 0 0 0 0 N074 0 0 BUF
A21 N072 0 0 0 N074 0 N073 0 AND
A22 N073 0 0 0 N076 0 N075 0 OR
A23 N075 0 N001 0 0 0 N072 0 DFLOP
A25 N055 0 0 0 N083 0 N082 0 AND
A26 N055 0 0 0 0 N080 0 0 BUF
A27 N078 0 0 0 N080 0 N079 0 AND
A28 N079 0 0 0 N082 0 N081 0 OR
A29 N081 0 N001 0 0 0 N078 0 DFLOP
A31 N055 0 0 0 N089 0 N088 0 AND
A32 N055 0 0 0 0 N086 0 0 BUF
A33 N084 0 0 0 N086 0 N085 0 AND
A34 N085 0 0 0 N088 0 N087 0 OR
A35 N087 0 N001 0 0 0 N084 0 DFLOP
A37 N055 0 0 0 N095 0 N094 0 AND
A38 N055 0 0 0 0 N092 0 0 BUF
A39 N090 0 0 0 N092 0 N091 0 AND
A40 N091 0 0 0 N094 0 N093 0 OR
A41 N093 0 N001 0 0 0 N090 0 DFLOP
A43 N055 0 0 0 N101 0 N100 0 AND
A44 N055 0 0 0 0 N098 0 0 BUF
A45 N096 0 0 0 N098 0 N097 0 AND
A46 N097 0 0 0 N100 0 N099 0 OR
A47 N099 0 N001 0 0 0 N096 0 DFLOP
V§Data1 N065 0 1
V§Data2 N071 0 0
V§Data3 N077 0 0
V§Data4 N083 0 1
V§Data5 N089 0 1
V§Data6 N095 0 0
V§Data7 N101 0 0
V§Enable N054 0 PULSE(0 1 10 1e-6 1e-6 2)
S1 N008 N052 N054 0 MYSW1
S2 N014 N060 N054 0 MYSW1
S3 N020 N066 N054 0 MYSW1
S4 N026 N072 N054 0 MYSW1
S5 N032 N078 N054 0 MYSW1
S6 N038 N084 N054 0 MYSW1
S7 N044 N090 N054 0 MYSW1
S8 N050 N096 N054 0 MYSW1
V§Load1 N005 0 PULSE(0 1 10 1e-9 1e-9 2)
A6 N005 0 0 0 N008 0 N009 0 AND
A12 N005 0 0 0 0 N006 0 0 BUF
A18 N002 0 0 0 N006 0 N003 0 AND
A24 N003 0 0 0 N009 0 N007 0 OR
A30 N007 0 N001 0 0 0 N002 0 DFLOP
A36 N005 0 0 0 N014 0 N015 0 AND
A42 N005 0 0 0 0 N012 0 0 BUF
A48 N010 0 0 0 N012 0 N011 0 AND
A49 N011 0 0 0 N015 0 N013 0 OR
A50 N013 0 N001 0 0 0 N010 0 DFLOP
A51 N005 0 0 0 N020 0 N021 0 AND
A52 N005 0 0 0 0 N018 0 0 BUF
A53 N016 0 0 0 N018 0 N017 0 AND
A54 N017 0 0 0 N021 0 N019 0 OR
A55 N019 0 N001 0 0 0 N016 0 DFLOP
A56 N005 0 0 0 N026 0 N027 0 AND
A57 N005 0 0 0 0 N024 0 0 BUF
A58 N022 0 0 0 N024 0 N023 0 AND
A59 N023 0 0 0 N027 0 N025 0 OR
A60 N025 0 N001 0 0 0 N022 0 DFLOP
A61 N005 0 0 0 N032 0 N033 0 AND
A62 N005 0 0 0 0 N030 0 0 BUF
A63 N028 0 0 0 N030 0 N029 0 AND
A64 N029 0 0 0 N033 0 N031 0 OR
A65 N031 0 N001 0 0 0 N028 0 DFLOP
A66 N005 0 0 0 N038 0 N039 0 AND
A67 N005 0 0 0 0 N036 0 0 BUF
A68 N034 0 0 0 N036 0 N035 0 AND
A69 N035 0 0 0 N039 0 N037 0 OR
A70 N037 0 N001 0 0 0 N034 0 DFLOP
A71 N005 0 0 0 N044 0 N045 0 AND
A72 N005 0 0 0 0 N042 0 0 BUF
A73 N040 0 0 0 N042 0 N041 0 AND
A74 N041 0 0 0 N045 0 N043 0 OR
A75 N043 0 N001 0 0 0 N040 0 DFLOP
A76 N005 0 0 0 N050 0 N051 0 AND
A77 N005 0 0 0 0 N048 0 0 BUF
A78 N046 0 0 0 N048 0 N047 0 AND
A79 N047 0 0 0 N051 0 N049 0 OR
A80 N049 0 N001 0 0 0 N046 0 DFLOP
V§Enable1 N004 0 0
S9 N008 N002 N004 0 MYSW1
S10 N014 N010 N004 0 MYSW1
S11 N020 N016 N004 0 MYSW1
S12 N026 N022 N004 0 MYSW1
S13 N032 N028 N004 0 MYSW1
S14 N038 N034 N004 0 MYSW1
S15 N044 N040 N004 0 MYSW1
S16 N050 N046 N004 0 MYSW1
R1 N008 0 1k
R2 N014 0 1k
R3 N020 0 1k
R4 N026 0 1k
R5 N032 0 1k
R6 N038 0 1k
R7 N044 0 1k
R8 N050 0 1k
R9 N008 0 1k
R10 N014 0 1k
R11 N020 0 1k
R12 N026 0 1k
R13 N032 0 1k
R14 N038 0 1k
R15 N044 0 1k
R16 N050 0 1k
.tran 20
* Register A
.model MYSW1 SW(Ron=1 Roff=1e12 Vt=.5 Vh=.4)
* Register B
* Least Significant Bit
* Most Significant Bit
* Objective:
* Move the value of 0011 0010 (50 in decimal) from registar A
* to registar B
* Least Significant Bit
* Most Significant Bit
* Bus
.backanno
.end